# Altium project 主板工程.PrjPCB
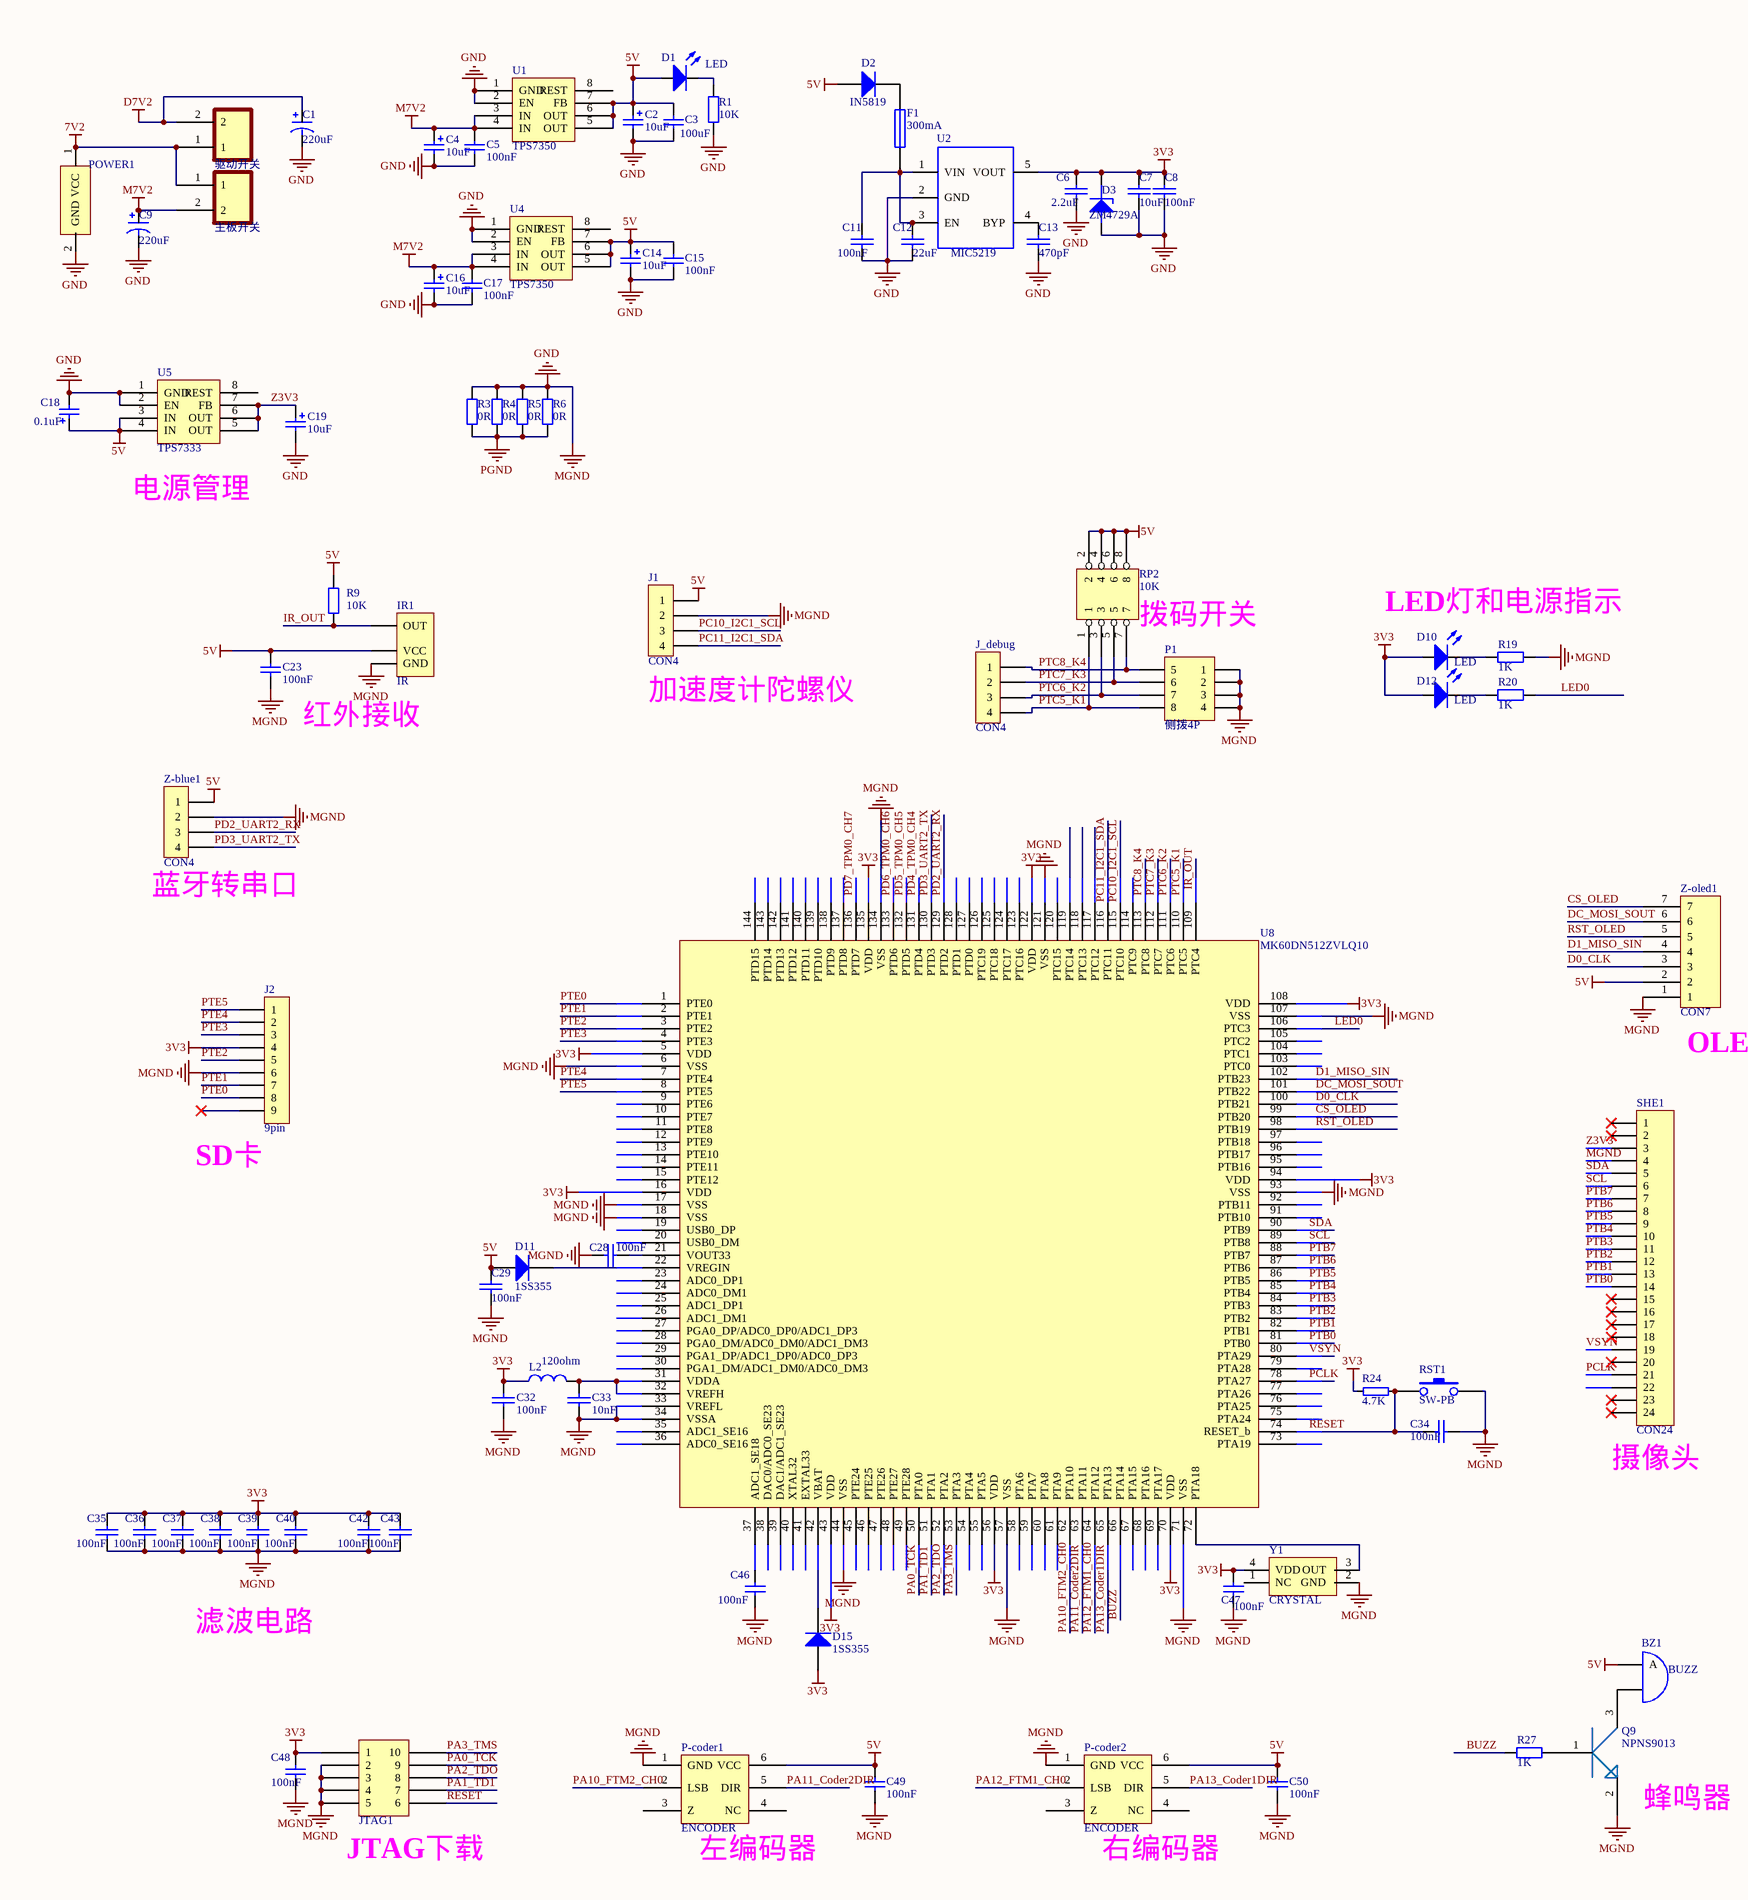
[diagram p0: 第十二届直立摄像头.SchDoc, left]
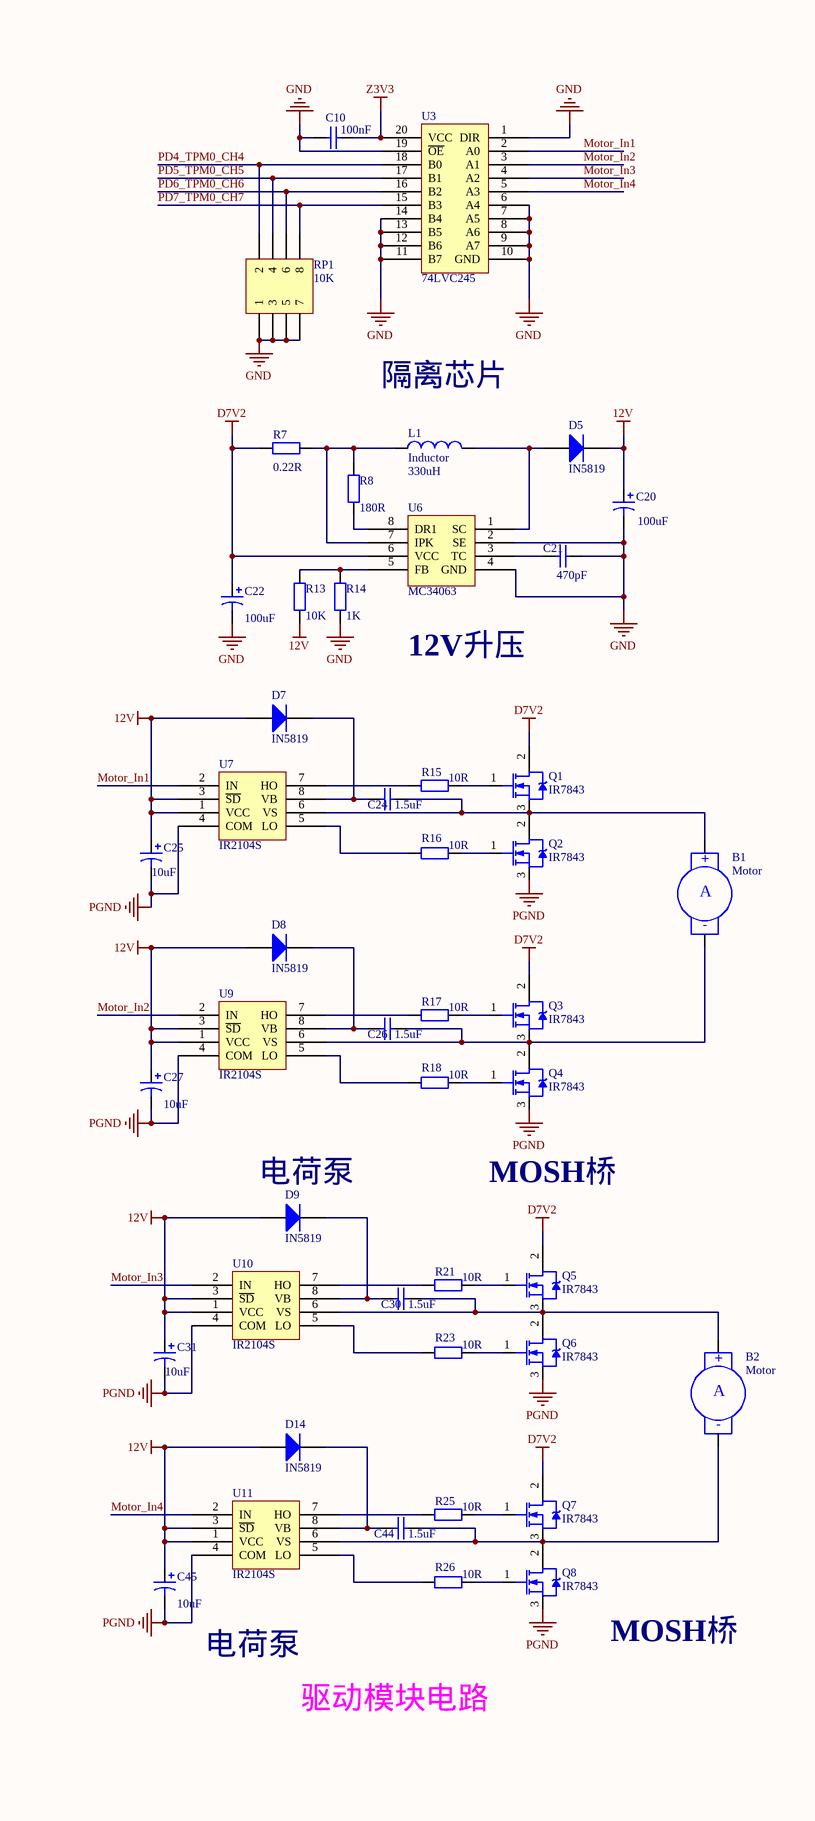
[diagram p1: 第十二届直立摄像头.SchDoc, right]
1 sheet, 127 parts. Net scope: global (net labels, ports and power ports of the same name join across sheets).
Board file: 第十二届直立摄像头.PcbDoc

## Sheet 第十二届直立摄像头.SchDoc
size A2

### Parts
B1  Motor  [KF301-2P]
B2  Motor  [KF301-2P]
BZ1  BUZZ  [BUZZ]
C1  CAP2  [铝电解电容10*10.2]  (value not drawn)
C2  10uF  [3216]
C3  100uF  [0603(1608)]
C4  10uF  [3216]
C5  100nF  [0603(1608)]
C6  2.2uF  [0603(1608)]
C7  10uF  [0603(1608)]
C8  100nF  [0603(1608)]
C9  CAP2  [铝电解电容10*10.2]  (value not drawn)
C10  value 100nF  [0603(1608)]  (hidden comment: Cap)
C11  100nF  [0603(1608)]
C12  22uF  [0603(1608)]
C13  470pF  [0603(1608)]
C14  10uF  [3216]
C15  100nF  [0603(1608)]
C16  10uF  [3216]
C17  100nF  [0603(1608)]
C18  0.1uF  [3216]
C19  10uF  [3216]
C20  value 100uF  [TAN-D7343]  (hidden comment: Cap Pol1)
C21  value 470pF  [0603(1608)]  (hidden comment: Cap)
C22  value 100uF  [TAN-D7343]  (hidden comment: Cap Pol1)
C23  100nF  [0603(1608)]
C24  value 1.5uF  [0603(1608)]  (hidden comment: Cap)
C25  value 10uF  [Tan-A3216]  (hidden comment: Cap Pol1)
C26  value 1.5uF  [0603(1608)]  (hidden comment: Cap)
C27  value 10uF  [Tan-A3216]  (hidden comment: Cap Pol1)
C28  100nF  [0603(1608)]
C29  100nF  [0603(1608)]
C30  value 1.5uF  [0603(1608)]  (hidden comment: Cap)
C31  value 10uF  [Tan-A3216]  (hidden comment: Cap Pol1)
C32  100nF  [0603(1608)]
C33  10nF  [0603(1608)]
C34  100nF  [0603(1608)]
C35  100nF  [0603(1608)]
C36  100nF  [0603(1608)]
C37  100nF  [0603(1608)]
C38  100nF  [0603(1608)]
C39  100nF  [0603(1608)]
C40  100nF  [0603(1608)]
C42  100nF  [0603(1608)]
C43  100nF  [0603(1608)]
C44  value 1.5uF  [0603(1608)]  (hidden comment: Cap)
C45  value 10uF  [Tan-A3216]  (hidden comment: Cap Pol1)
C46  100nF  [0603(1608)]
C47  100nF  [0603(1608)]
C48  100nF  [0603(1608)]
C49  100nF  [0603(1608)]
C50  100nF  [0603(1608)]
D1  LED  [0603LED]
D2  IN5819  [SS14]
D3  ZM4729A  [LL-41]
D5  IN5819  [SS14]
D7  IN5819  [SS14]
D8  IN5819  [SS14]
D9  IN5819  [SS14]
D10  LED  [0603LED]
D11  1SS355  [0805(有极性)]
D12  LED  [0603LED]
D14  IN5819  [SS14]
D15  1SS355  [0805(有极性)]
F1  300mA  [保险丝]
IR1  IR  [IR2]
J1  CON4  [CON4-1]
J2  9pin  [SD]
J_debug  CON4  [CON4-1]
JTAG1  JTAG  [IDC5X2]  (value not drawn)
L1  Inductor  value 330uH  [贴片电感7*7*4]
L2  120ohm  [0805 - duplicate]
P1  侧拨4P  [侧拨4P]
P-coder1  ENCODER  [ENCODER]
P-coder2  ENCODER  [ENCODER]
POWER1  (no value)  [T槽]
Q1  IR7843  [LR7843]
Q2  IR7843  [LR7843]
Q3  IR7843  [LR7843]
Q4  IR7843  [LR7843]
Q5  IR7843  [LR7843]
Q6  IR7843  [LR7843]
Q7  IR7843  [LR7843]
Q8  IR7843  [LR7843]
Q9  NPNS9013  [S9013]
R1  10K  [0603(1608)]
R3  0R  [0805(2012)]
R4  0R  [0805(2012)]
R5  0R  [0805(2012)]
R6  0R  [0805(2012)]
R7  value 0.22R  [0603(1608)]  (hidden comment: Res2)
R8  180R  [0603(1608)]
R9  value 10K  [0603(1608)]  (hidden comment: 1K)
R13  value 10K  [0603(1608)]  (hidden comment: Res2)
R14  value 1K  [0603(1608)]  (hidden comment: Res2)
R15  value 10R  [0603(1608)]  (hidden comment: Res2)
R16  value 10R  [0603(1608)]  (hidden comment: Res2)
R17  value 10R  [0603(1608)]  (hidden comment: Res2)
R18  value 10R  [0603(1608)]  (hidden comment: Res2)
R19  1K  [0603(1608)]
R20  1K  [0603(1608)]
R21  value 10R  [0603(1608)]  (hidden comment: Res2)
R23  value 10R  [0603(1608)]  (hidden comment: Res2)
R24  4.7K  [0603(1608)]
R25  value 10R  [0603(1608)]  (hidden comment: Res2)
R26  value 10R  [0603(1608)]  (hidden comment: Res2)
R27  1K  [0603(1608)]
RP1  10K  [RA_8]
RP2  HEADER4*2  [RA_8]  (value not drawn)
RST1  SW-PB  [SMT_BUTTON]
SHE1  CON24  [24P压线头]
U1  TPS7350  [SOIC-8]
U2  MIC5219  [SOT-23-5]
U3  74LVC245  [74LVC245 TSSOP]
U4  TPS7350  [SOIC-8]
U5  TPS7333  [SOIC-8]
U6  MC34063  [MC34063]
U7  IR2104S  [IR2104]
U8  MK60DN512ZVLQ10  [LQFP-144]
U9  IR2104S  [IR2104]
U10  IR2104S  [IR2104]
U11  IR2104S  [IR2104]
Y1  CRYSTAL  [SMD7050]
Z-blue1  CON4  [Bluetooth]
Z-oled1  CON7  [CON7_OLED]
主板开关1  主板开关  [船型开关-small]
驱动开关1  驱动开关  [船型开关-small]

### Nets
3V3: C6.2 C7.2 C8.2 C32.2 C35.2 C36.2 C37.2 C38.2 C39.2 C40.2 C42.2 C43.2 C47.2 C48.2 D3.2(B) D10.1 D12.1 D15.1(A) J2.4 JTAG1.1 L2.2 R24.2 U2.5(VOUT) U8.5(VDD) U8.16(VDD) U8.43(VDD) U8.56(VDD) U8.70(VDD) U8.94(VDD) U8.108(VDD) U8.122(VDD) U8.135(VDD) Y1.4(VDD)
5V: BZ1.1(A) C2.1 C3.2 C14.1 C15.2 C18.1 C23.2 C29.2 C49.1 C50.1 D1.1 D2.1(A) D11.1(A) IR1.2(VCC) J1.1 P-coder1.6(VCC) P-coder2.6(VCC) R9.2 RP2.2 RP2.4 RP2.6 RP2.8 U1.5(OUT) U1.6(OUT) U1.7(FB) U4.5(OUT) U4.6(OUT) U4.7(FB) U5.3(IN) U5.4(IN) Z-blue1.1 Z-oled1.2
7V2: POWER1.1(VCC) 主板开关1.1 驱动开关1.1
12V: C20.1 C25.1 C27.1 C31.1 C45.1 D5.2(K) D7.1(A) D8.1(A) D9.1(A) D14.1(A) R13.1 U7.1(VCC) U7.3(~{SD}) U9.1(VCC) U9.3(~{SD}) U10.1(VCC) U10.3(~{SD}) U11.1(VCC) U11.3(~{SD})
D7V2: C1.1 C22.1 Q1.2(D) Q3.2(D) Q5.2(D) Q7.2(D) R7.2 U6.6(VCC) 驱动开关1.2
M7V2: C4.1 C5.1 C9.1 C16.1 C17.2 U1.3(IN) U1.4(IN) U4.3(IN) U4.4(IN) 主板开关1.2
MGND: C1.2 C2.2 C3.1 C4.2 C5.2 C6.1 C7.1 C8.1 C9.2 C10.1 C11.1 C12.1 C13.1 C14.2 C15.1 C16.2 C17.1 C18.2 C19.2 C20.2 C21.2 C22.2 C23.1 C28.1 C29.1 C32.1 C33.1 C34.2 C35.1 C36.1 C37.1 C38.1 C39.1 C40.1 C42.1 C43.1 C46.1 C47.1 C48.1 C49.2 C50.2 D3.1(A) IR1.1(GND) J1.2 J2.6 JTAG1.2 JTAG1.3 JTAG1.4 JTAG1.5 P1.1 P1.2 P1.3 P1.4 P-coder1.1(GND) P-coder2.1(GND) POWER1.2(GND) Q9.2 R1.1 R3.2 R4.2 R5.2 R6.2 R14.1 R19.2 RP1.1 RP1.3 RP1.5 RP1.7 RST1.2 SHE1.4 U1.1(GND) U1.2(EN) U2.2(GND) U3.1(DIR) U3.6(A4) U3.7(A5) U3.8(A6) U3.9(A7) U3.10(GND) U3.11(B7) U3.12(B6) U3.13(B5) U3.14(B4) U3.19(~{OE}) U4.1(GND) U4.2(EN) U5.1(GND) U5.2(EN) U6.2(SE) U6.4(GND) U8.6(VSS) U8.17(VSS) U8.18(VSS) U8.33(VREFL) U8.34(VSSA) U8.44(VSS) U8.57(VSS) U8.71(VSS) U8.93(VSS) U8.107(VSS) U8.121(VSS) U8.134(VSS) Y1.2(GND) Z-blue1.2 Z-oled1.1  [also labelled GND]
PGND: C25.2 C27.2 C31.2 C45.2 Q2.3(S) Q4.3(S) Q6.3(S) Q8.3(S) R3.1 R4.1 R5.1 R6.1 U7.4(COM) U9.4(COM) U10.4(COM) U11.4(COM)
Z3V3: C10.2 C19.1 SHE1.3 U3.20(VCC) U5.5(OUT) U5.6(OUT) U5.7(FB)
BUZZ: R27.2 U8.66(PTA14)
CS_OLED: U8.99(PTB20) Z-oled1.7
D0_CLK: U8.100(PTB21) Z-oled1.3
D1_MISO_SIN: U8.102(PTB23) Z-oled1.4
DC_MOSI_SOUT: U8.101(PTB22) Z-oled1.6
IR_OUT: IR1.3(OUT) R9.1 U8.109(PTC4)
LED0: R20.2 U8.106(PTC3)
Motor_In1: U3.2(A0) U7.2(IN)
Motor_In2: U3.3(A1) U9.2(IN)
Motor_In3: U3.4(A2) U10.2(IN)
Motor_In4: U3.5(A3) U11.2(IN)
PA0_TCK: JTAG1.9 U8.50(PTA0)
PA1_TD1: JTAG1.7 U8.51(PTA1)
PA2_TDO: JTAG1.8 U8.52(PTA2)
PA3_TMS: JTAG1.10 U8.53(PTA3)
PA10_FTM2_CH0: P-coder1.2(LSB) U8.62(PTA10)
PA11_Coder2DIR: P-coder1.5(DIR) U8.63(PTA11)
PA12_FTM1_CH0: P-coder2.2(LSB) U8.64(PTA12)
PA13_Coder1DIR: P-coder2.5(DIR) U8.65(PTA13)
PC10_I2C1_SCL: J1.3 U8.115(PTC10)
PC11_I2C1_SDA: J1.4 U8.116(PTC11)
PCLK: SHE1.21 U8.78(PTA27)
PD2_UART2_RX: U8.129(PTD2) Z-blue1.3
PD3_UART2_TX: U8.130(PTD3) Z-blue1.4
PD4_TPM0_CH4: RP1.2 U3.18(B0) U8.131(PTD4)
PD5_TPM0_CH5: RP1.4 U3.17(B1) U8.132(PTD5)
PD6_TPM0_CH6: RP1.6 U3.16(B2) U8.133(PTD6)
PD7_TPM0_CH7: RP1.8 U3.15(B3) U8.136(PTD7)
PTB0: SHE1.14 U8.81(PTB0)
PTB1: SHE1.13 U8.82(PTB1)
PTB2: SHE1.12 U8.83(PTB2)
PTB3: SHE1.11 U8.84(PTB3)
PTB4: SHE1.10 U8.85(PTB4)
PTB5: SHE1.9 U8.86(PTB5)
PTB6: SHE1.8 U8.87(PTB6)
PTB7: SHE1.7 U8.88(PTB7)
PTC5_K1: J_debug.4 P1.8 RP2.1 U8.110(PTC5)
PTC6_K2: J_debug.3 P1.7 RP2.3 U8.111(PTC6)
PTC7_K3: J_debug.2 P1.6 RP2.5 U8.112(PTC7)
PTC8_K4: J_debug.1 P1.5 RP2.7 U8.113(PTC8)
PTE0: J2.8 U8.1(PTE0)
PTE1: J2.7 U8.2(PTE1)
PTE2: J2.5 U8.3(PTE2)
PTE3: J2.3 U8.4(PTE3)
PTE4: J2.2 U8.7(PTE4)
PTE5: J2.1 U8.8(PTE5)
RESET: C34.1 JTAG1.6 R24.1 RST1.1 U8.74(RESET_b)
RST_OLED: U8.98(PTB19) Z-oled1.5
SCL: SHE1.6 U8.89(PTB8)
SDA: SHE1.5 U8.90(PTB9)
VSYN: SHE1.19 U8.80(PTA29)
NetB1_1: B1.1(+) C24.2 Q1.3(S) Q2.2(D) U7.6(VS)
NetB1_2: B1.2(-) C26.2 Q3.3(S) Q4.2(D) U9.6(VS)
NetB2_1: B2.1(+) C30.2 Q5.3(S) Q6.2(D) U10.6(VS)
NetB2_2: B2.2(-) C44.2 Q7.3(S) Q8.2(D) U11.6(VS)
NetBZ1_2: BZ1.2(B) Q9.3
NetC11_2: C11.2 C12.2 F1.1 U2.1(VIN) U2.3(EN)
NetC13_2: C13.2 U2.4(BYP)
NetC21_1: C21.1 U6.3(TC)
NetC24_1: C24.1 D7.2(K) U7.8(VB)
NetC26_1: C26.1 D8.2(K) U9.8(VB)
NetC28_2: C28.2 U8.21(VOUT33)
NetC30_1: C30.1 D9.2(K) U10.8(VB)
NetC33_2: C33.2 L2.1 U8.31(VDDA) U8.32(VREFH)
NetC44_1: C44.1 D14.2(K) U11.8(VB)
NetC46_2: C46.2 U8.37(ADC1_SE18)
NetD1_2: D1.2 R1.2
NetD2_2: D2.2(K) F1.2
NetD5_1: D5.1(A) L1.2 U6.1(SC)
NetD10_2: D10.2 R19.1
NetD11_2: D11.2(K) U8.22(VREGIN)
NetD12_2: D12.2 R20.1
NetD15_2: D15.2(K) U8.42(VBAT)
NetL1_1: L1.1 R7.1 R8.2 U6.7(IPK)
NetQ1_1: Q1.1(G) R15.2
NetQ2_1: Q2.1(G) R16.2
NetQ3_1: Q3.1(G) R17.2
NetQ4_1: Q4.1(G) R18.2
NetQ5_1: Q5.1(G) R21.2
NetQ6_1: Q6.1(G) R23.2
NetQ7_1: Q7.1(G) R25.2
NetQ8_1: Q8.1(G) R26.2
NetQ9_1: Q9.1 R27.1
NetR8_1: R8.1 U6.8(DR1)
NetR13_2: R13.2 R14.2 U6.5(FB)
NetR15_1: R15.1 U7.7(HO)
NetR16_1: R16.1 U7.5(LO)
NetR17_1: R17.1 U9.7(HO)
NetR18_1: R18.1 U9.5(LO)
NetR21_1: R21.1 U10.7(HO)
NetR23_1: R23.1 U10.5(LO)
NetR25_1: R25.1 U11.7(HO)
NetR26_1: R26.1 U11.5(LO)
NetU8_72: U8.72(PTA18) Y1.3(OUT)

Not connected (* = marked no-connect by the designer): J2 9*; P-coder1 3(Z) 4(NC); P-coder2 3(Z) 4(NC); SHE1 1* 2* 15* 16* 17* 18* 20* 22 23* 24*; U1 8(REST); U4 8(REST); U5 8(REST); U8 9(PTE6) 10(PTE7) 11(PTE8) 12(PTE9) 13(PTE10) 14(PTE11) 15(PTE12) 19(USB0_DP) 20(USB0_DM) 23(ADC0_DP1) 24(ADC0_DM1) 25(ADC1_DP1) 26(ADC1_DM1) 27(PGA0_DP/ADC0_DP0/ADC1_DP3) 28(PGA0_DM/ADC0_DM0/ADC1_DM3) 29(PGA1_DP/ADC1_DP0/ADC0_DP3) 30(PGA1_DM/ADC1_DM0/ADC0_DM3) 35(ADC1_SE16) 36(ADC0_SE16) 38(DAC0/ADC0_SE23) 39(DAC1/ADC1_SE23) 40(XTAL32) 41(EXTAL33) 45(PTE24) 46(PTE25) 47(PTE26) 48(PTE27) 49(PTE28) 54(PTA4) 55(PTA5) 58(PTA6) 59(PTA7) 60(PTA8) 61(PTA9) 67(PTA15) 68(PTA16) 69(PTA17) 73(PTA19) 75(PTA24) 76(PTA25) 77(PTA26) 79(PTA28) 91(PTB10) 92(PTB11) 95(PTB16) 96(PTB17) 97(PTB18) 103(PTC0) 104(PTC1) 105(PTC2) 114(PTC9) 117(PTC12) 118(PTC13) 119(PTC14) 120(PTC15) 123(PTC16) 124(PTC17) 125(PTC18) 126(PTC19) 127(PTD0) 128(PTD1) 137(PTD8) 138(PTD9) 139(PTD10) 140(PTD11) 141(PTD12) 142(PTD13) 143(PTD14) 144(PTD15); Y1 1(NC)

### Notes on the sheet
- 隔离芯片
- (near U5) 电源管理
- (near RP2) 拨码开关
- LED灯和电源指示
- 红外接收
- (near J1) 加速度计陀螺仪
- 12V升压
- (near Z-blue1) 蓝牙转串口
- (near Z-oled1) OLED
- (near J2) SD卡
- (near D9) 电荷泵
- MOSH桥
- (near SHE1) 摄像头
- 滤波电路
- 电荷泵
- 驱动模块电路
- (near JTAG1) JTAG下载
- (near P-coder1) 左编码器
- (near P-coder2) 右编码器
- (near Q9) 蜂鸣器
- Title
- Size:
- Date:
- File:
- A2
- Number:
- Time:
- Revision:
- Sheet
- of
- (in symbol CAP2) 220uF
- (in symbol HEADER4*2) 10K
- (in symbol Motor Servo) A

### Library data of the parts
B1 B2 = Motor Servo: Servo Motor
C1 C9 = CAP2: 电容带极性
C2 C4 C14 C16 C18 C19 = 电容
C3 C5 C10 C15 C17 C21 C24 C26 C30 C44 C48-C50 = Cap: Capacitor
  C10 C21 C24 C26 C30 C44: Published: 8-Jun-2000; LatestRevisionDate: 17-Jul-2002; LatestRevisionNote: Re-released for DXP Platform.; PackageReference: RAD-0.3; Publisher: Altium Limited; PackageDescription: Radial Cap, Thru-Hole; 2 Leads; 0.3 in Pin Spacing
C6-C8 C11-C13 C28 C29 C32-C40 C42 C43 = 普通电容: Capacitor
C20 C22 C25 C27 C31 C45 = Cap Pol1: Polarized Capacitor (Radial); Published: 8-Jun-2000; LatestRevisionDate: 17-Jul-2002; LatestRevisionNote: Re-released for DXP Platform.; PackageReference: RB7.6-15; Publisher: Altium Limited; PackageDescription: Polarized Capacitor (Radial); 2 Leads
C23 C46 C47 = Cap_1: Capacitor; Published: 8-Jun-2000; LatestRevisionDate: 17-Jul-2002; LatestRevisionNote: Re-released for DXP Platform.; PackageReference: RAD-0.3; Publisher: Altium Limited; PackageDescription: Radial Cap, Thru-Hole; 2 Leads; 0.3 in Pin Spacing; Value: 100nF
D1 D10 D12 = LED: Typical INFRARED GaAs LED
D2 D5 D7-D9 D14 = Diode: Default Diode; Published: 8-Jun-2000; LatestRevisionDate: 17-Jul-2002; LatestRevisionNote: Re-released for DXP Platform.; PackageVersion: Sep-1996; PackageReference: SMC; Publisher: Altium Limited; PackageDescription: DO-214-AB/SMC; 2 C-Bend Leads; Body 7.9 x 5.9 mm, inc. leads (LxW); Code_JEDEC: DO-214-AB
D3 = 稳压二极管: Zener Diode
D11 D15 = Diode 1N4148: High Conductance Fast Diode; LatestRevisionDate: 17-Jul-2002; LatestRevisionNote: Re-released for DXP Platform.; DatasheetDocument: 1997; PackageReference: DO-35; Publisher: Altium Limited; Code_JEDEC: DO-204-AH; ComponentLink1Description: Manufacturer Link; ComponentLink2Description: Datasheet; ComponentLink2URL: http://www.fairchildsemi.com/ds/1N%2F1N4148.pdf
F1 = Fuse 1: Fuse; Published: 8-Jun-2000; LatestRevisionDate: 17-Jul-2002; LatestRevisionNote: Re-released for DXP Platform.; PackageReference: PIN-W2/E2.8; Publisher: Altium Limited
IR1 = IR_2
L1 = Inductor: Code_IEC: 1005; Published: 8-Jun-2000; LatestRevisionDate: 29-May-2009; LatestRevisionNote: IPC-7351 Footprint Added.; PackageReference: 0402-A; Publisher: Altium Limited; PackageDescription: Chip Inductor; Code_JEITA: 0402
L2 = L
POWER1 = T槽
Q1-Q8 = NMOS-2: N-Channel Power MOSFET; Note: Pin 2 is electrically connected to pin 4.; Published: 8-Jun-2000; LatestRevisionDate: 17-Jul-2002; LatestRevisionNote: Re-released for DXP Platform.; DatasheetVersion: PD-9.814; PackageVersion: Feb-1997; PackageReference: TO-220AB; Publisher: Altium Limited; PackageDescription: TO, Thru-Hole, Vertical, Heatsink Mounted; 3 In-Line Leads; Pitch 2.54 mm; ComponentLink1Description: Manufacturer Link; ComponentLink1URL: http://www.irf.com/
Q9 = S9013
R1 = Res2: Resistor; Value: 1K; Published: 8-Jun-2000; LatestRevisionDate: 17-Jul-2002; LatestRevisionNote: Re-released for DXP Platform.; PackageReference: AXIAL-0.4; Publisher: Altium Limited; PackageDescription: Axial Device, Thru-Hole; 2 Leads; 0.4 in Pin Spacing
R3-R6 R24 = RES
R7 R8 R13-R18 R21 R23 R25 R26 = Res2: Resistor; Published: 8-Jun-2000; LatestRevisionDate: 17-Jul-2002; LatestRevisionNote: Re-released for DXP Platform.; PackageReference: AXIAL-0.4; Publisher: Altium Limited; PackageDescription: Axial Device, Thru-Hole; 2 Leads; 0.4 in Pin Spacing
  R8: Value: 180R
R9 R27 = Res2_2: Resistor; Published: 8-Jun-2000; LatestRevisionDate: 17-Jul-2002; LatestRevisionNote: Re-released for DXP Platform.; PackageReference: AXIAL-0.4; Publisher: Altium Limited; PackageDescription: Axial Device, Thru-Hole; 2 Leads; 0.4 in Pin Spacing
  R27: Value: 1K
R19 R20 = Res2_1: Resistor; Published: 8-Jun-2000; LatestRevisionDate: 17-Jul-2002; LatestRevisionNote: Re-released for DXP Platform.; PackageReference: AXIAL-0.4; Publisher: Altium Limited; PackageDescription: Axial Device, Thru-Hole; 2 Leads; 0.4 in Pin Spacing; Value: 1K
RP1 = Header 4X2: Header, 4-Pin, Dual row; LatestRevisionDate: 17-Jul-2002; LatestRevisionNote: Re-released for DXP Platform.; Publisher: Altium Limited
RST1 = 微动开关
U1 U4 U5 = TPS
U2 = MIC5219: LDO
主板开关1 驱动开关1 = 船型开关